# Altium schematic sheet 2_Smoke_detector.SchDoc (part 4 of 6)
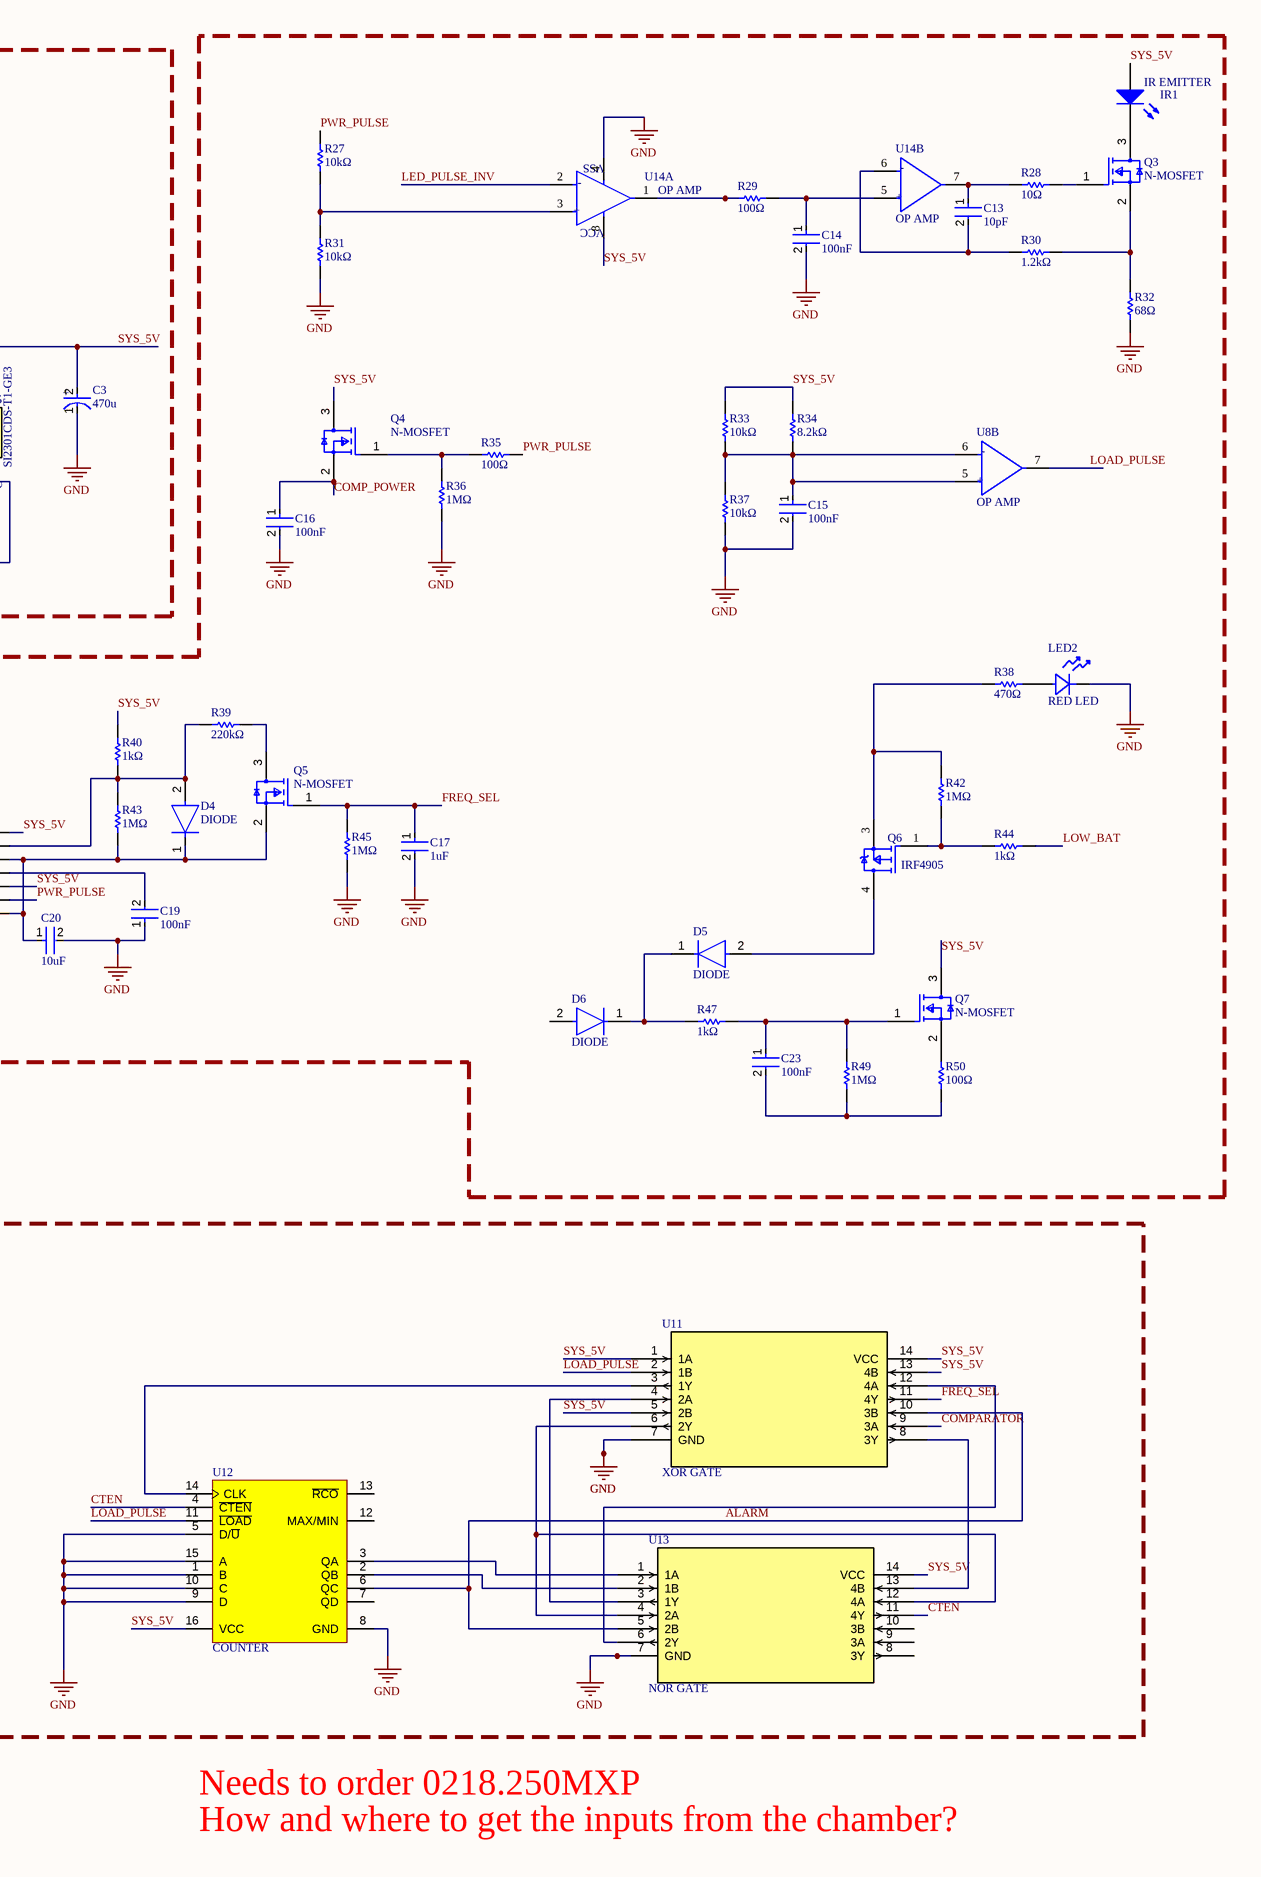
[diagram p4: 2_Smoke_detector.SchDoc, right]

## Library data of the parts (continued)
Q6 = IRF4905STRLPBF: MOSFET P-CH 55V 42A D2PAK; Manufacturer: Infineon; Drain to Source Breakdown Voltage: -55V; Drain to Source Resistance: 20mΩ; Element Configuration: Single; Fall Time: 64ns; Gate to Source Voltage (Vgs): 20V; Input Capacitance: 3.5nF; Max Junction Temperature (Tj): 150°C; Max Power Dissipation: 170W; Nominal Vgs: 4V; Number of Channels: 1; Power Dissipation: 150W; Value: 20mΩ; Rise Time: 99ns; Turn-Off Delay Time: 51ns; Turn-On Delay Time: 20ns; Supplier: Future Electronics; Supplier Part Number: IRF4905STRLPBF; Manufacturer Part Number: IRF4905STRLPBF; RoHS: Compliant; Category: MOSFETs; Stock: 20800; Pricing: 800=2.4 (USD); Case/Package: D2PAK; China RoHS: Non-Compliant; Continuous Drain Current (ID): 42A; Country of Origin: Mainland China; Drain to Source Voltage (Vdss): -55V; Dual Supply Voltage: 55V; Export Control Classification Number (ECCN) Code: EAR99; Height: 5.084mm; Harmonized Tariff Schedule (HTS) Code: 8541.29.00.95; Introduction Date: 1996-07-26; Lead Free: Lead Free; Length: 10.67mm; Lifecycle Status: Production; Max Operating Temperature: 150°C; Min Breakdown Voltage: 55V; Min Operating Temperature: -55°C; Mounting Technology: Surface Mount; Number of Elements: 1; Pins: 3; Number of Terminals: 2; On-State Resistance: 20mΩ; Package Quantity: 800; Packaging: Cut Tape; Radiation Hardening: No; Rds On Max: 20mΩ; REACH SVHC: Affected; Schedule B: 8541290080, 8541290080|8541290080|8541290080|8541290080|8541290080|8541290080|8541290080|8541290080|8541290080|8541290080|8541290080|8541290080|8541290080|8541290080|8541290080|8541290080|8541290080|8541290080|8541290080|8541290080|8541290080|8541290080|8541290080|85; Termination: SMD/SMT; Threshold Voltage: 4V; Width: 9.65mm; ComponentLink1URL: https://datasheet.octopart.com:443/IRF4905STRLPBF-Infineon-datasheet-7823242.pdf?src-supplier=element14+APAC; ComponentLink1Description: https://datasheet.octopart.com:443/IRF4905STRLPBF-Infineon-datasheet-7823242.pdf?src-supplier=element14+APAC; ComponentLink2URL: https://datasheet.octopart.com:443/IRF4905STRLPBF-Infineon-datasheet-6397759.pdf?src-supplier=element14+APAC; ComponentLink2Description: https://datasheet.octopart.com:443/IRF4905STRLPBF-Infineon-datasheet-6397759.pdf?src-supplier=element14+APAC; ComponentLink3URL: https://datasheet.octopart.com:443/IRF4905STRLPBF-Infineon-datasheet-180067141.pdf?src-supplier=IHS; ComponentLink3Description: https://datasheet.octopart.com:443/IRF4905STRLPBF-Infineon-datasheet-180067141.pdf?src-supplier=IHS; ComponentLink4URL: https://datasheet.octopart.com:443/IRF4905STRLPBF-Infineon-datasheet-9781395.pdf?src-supplier=RS+(Formerly+Allied+Electronics); ComponentLink4Description: https://datasheet.octopart.com:443/IRF4905STRLPBF-Infineon-datasheet-9781395.pdf?src-supplier=RS+(Formerly+Allied+Electronics); ComponentLink5URL: https://datasheet.octopart.com:443/IRF4905STRLPBF-International-Rectifier-datasheet-8761984.pdf?src-supplier=Jameco+(USA); ComponentLink5Description: https://datasheet.octopart.com:443/IRF4905STRLPBF-International-Rectifier-datasheet-8761984.pdf?src-supplier=Jameco+(USA); ComponentLink6URL: https://datasheet.octopart.com:443/IRF4905STRLPBF-International-Rectifier-datasheet-14060552.pdf?src-supplier=iiiC; ComponentLink6Description: https://datasheet.octopart.com:443/IRF4905STRLPBF-International-Rectifier-datasheet-14060552.pdf?src-supplier=iiiC; ComponentLink7URL: http://sigma.octopart.com:80/conflict_mineral_statement/Infineon-company-51.pdf?src-supplier=Compliance+Statements; ComponentLink7Description: http://sigma.octopart.com:80/conflict_mineral_statement/Infineon-company-51.pdf?src-supplier=Compliance+Statements; ComponentLink8URL: http://sigma.octopart.com:80/reach_statement/International-Rectifier-company-55.pdf?src-supplier=Compliance+Statements; ComponentLink8Description: http://sigma.octopart.com:80/reach_statement/International-Rectifier-company-55.pdf?src-supplier=Compliance+Statements; ComponentLink9URL: http://sigma.octopart.com:80/rohs_statement/International-Rectifier-company-54.pdf?src-supplier=Compliance+Statements; ComponentLink9Description: http://sigma.octopart.com:80/rohs_statement/International-Rectifier-company-54.pdf?src-supplier=Compliance+Statements; LCSC Part Number: C2620
R1 = RT0805BRD0728K7L: RES 28.7kΩ 0.1% 1/8W 0805; Manufacturer: Yageo Group; Manufacturer Package Identifier: 0805 (2012 metric); Max Power Dissipation: 125mW; Temperature Coefficient: 25ppm/°C; Voltage Rating: 150V; Supplier: Avnet; Supplier Part Number: RT0805BRD0728K7L; Manufacturer Part Number: RT0805BRD0728K7L; RoHS: Compliant; Category: Chip SMD Resistors; Pricing: 5000=0.0408, 10000=0.0406, 20000=0.04039, 40000=0.04019, 80000=0.03998 (USD); Case/Package: 0805; Case Code (Imperial): 0805; China RoHS: Non-Compliant; Composition: Thin Film; Country of Origin: Mainland China, Taiwan; Depth: 1.25mm; Export Control Classification Number (ECCN) Code: EAR99; Height: 500µm; Harmonized Tariff Schedule (HTS) Code: 8533.21.00.30; Introduction Date: 2008-06-09; Lead Free: Lead Free; Length: 2mm; Lifecycle Status: Production; Max Operating Temperature: 155°C; Military Standard: Not; Min Operating Temperature: -55°C; Mounting Technology: Surface Mount; Number of Terminals: 2; Number of Terminations: 2; Power Rating: 125mW; REACH SVHC: Unaffected; Value: 28.7kΩ; Termination: SMD/SMT; Tolerance: 0.1%; Voltage Rating (DC): 150V; Weight: 5.499807mg; Width: 1.25mm; Working Voltage: 150V; ComponentLink1URL: https://datasheet.octopart.com:443/RT0805BRD0728K7L-Yageo-datasheet-176402239.pdf?src-supplier=IHS; ComponentLink1Description: https://datasheet.octopart.com:443/RT0805BRD0728K7L-Yageo-datasheet-176402239.pdf?src-supplier=IHS; ComponentLink2URL: https://datasheet.octopart.com:443/RT0805BRD0728K7L-Yageo-datasheet-96443642.pdf?src-supplier=Upverter; ComponentLink2Description: https://datasheet.octopart.com:443/RT0805BRD0728K7L-Yageo-datasheet-96443642.pdf?src-supplier=Upverter; ComponentLink3URL: https://datasheet.octopart.com:443/RT0805BRD0728K7L-Yageo-Group-datasheet-141265893.pdf?src-supplier=ODG+(Origin+Data+Global); ComponentLink3Description: https://datasheet.octopart.com:443/RT0805BRD0728K7L-Yageo-Group-datasheet-141265893.pdf?src-supplier=ODG+(Origin+Data+Global); ComponentLink4URL: https://datasheet.octopart.com/RT0805BRD0728K7L-Yageo-datasheet-86813807.pdf; ComponentLink4Description: https://datasheet.octopart.com/RT0805BRD0728K7L-Yageo-datasheet-86813807.pdf; ComponentLink5URL: http://sigma.octopart.com:80/conflict_mineral_statement/Yageo-company-3.pdf?src-supplier=Compliance+Statements; ComponentLink5Description: http://sigma.octopart.com:80/conflict_mineral_statement/Yageo-company-3.pdf?src-supplier=Compliance+Statements; ComponentLink6URL: http://sigma.octopart.com:80/rohs_statement/Yageo-company-2.pdf?src-supplier=Compliance+Statements; ComponentLink6Description: http://sigma.octopart.com:80/rohs_statement/Yageo-company-2.pdf?src-supplier=Compliance+Statements; LCSC Part Number: C865355
R2 R11 R16 R20 R22 R24 R25 R27 R31 R33 R37 = CRCW080510K0FKEA: RES 10kΩ 1% 1/8W 0805; Manufacturer: Vishay; Manufacturer Package Identifier: CRCW0805-e3; Power Rating: 125mW; Temperature Coefficient: 100ppm/°C; Voltage Rating: 150V; Supplier: Future Electronics; Supplier Part Number: CRCW080510K0FKEA; Manufacturer Part Number: CRCW080510K0FKEA; RoHS: Compliant; Category: Chip SMD Resistors; Stock: 5460000; Pricing: 10000=0.0023, 50000=0.0022, 125000=0.0022, 375000=0.0021, 750000=0.002 (USD); Case/Package: 0805; Case Code (Imperial): 0805; China RoHS: Non-Compliant; Composition: Thick Film; Contact Plating: Tin; Country of Origin: Israel; Depth: 1.25mm; Export Control Classification Number (ECCN) Code: EAR99; Height: 450µm; Harmonized Tariff Schedule (HTS) Code: 8533.21.00.30; Introduction Date: 2005-02-16; Lead Free: Lead Free; Length: 2mm; Lifecycle Status: Production; Max Operating Temperature: 155°C; Military Standard: Not; Min Operating Temperature: -55°C; Mounting Technology: Surface Mount; Pins: 2; Number of Terminals: 2; Packaging: Cut Tape; Radiation Hardening: No; Ratings: AEC-Q200; REACH SVHC: Unaffected; Value: 10kΩ; Schedule B: 8533210045, 8533210045|8533210045|8533210045|8533210045|8533210045|8533210045|8533210045|8533210045|8533210045|8533210045|8533210045|8533210045|8533210045|8533210045|8533210045|8533210045|8533210045|8533210045|8533210045|8533210045|8533210045|8533210045|8533210045|85; Termination: SMD/SMT; Tolerance: 1%; Voltage Rating (DC): 150V; Weight: 5.499807mg; Width: 1.25mm; Working Voltage: 150V; ComponentLink1URL: https://datasheet.octopart.com:443/CRCW080510K0FKEA-Vishay-datasheet-175423584.pdf?src-supplier=IHS; ComponentLink1Description: https://datasheet.octopart.com:443/CRCW080510K0FKEA-Vishay-datasheet-175423584.pdf?src-supplier=IHS; ComponentLink2URL: https://datasheet.octopart.com:443/CRCW080510K0FKEA-Vishay-datasheet-5300368.pdf?src-supplier=Future+Electronics; ComponentLink2Description: https://datasheet.octopart.com:443/CRCW080510K0FKEA-Vishay-datasheet-5300368.pdf?src-supplier=Future+Electronics; ComponentLink3URL: https://datasheet.octopart.com:443/CRCW080510K0FKEA-Vishay-datasheet-62316122.pdf?src-supplier=Future+Electronics; ComponentLink3Description: https://datasheet.octopart.com:443/CRCW080510K0FKEA-Vishay-datasheet-62316122.pdf?src-supplier=Future+Electronics; ComponentLink4URL: https://datasheet.octopart.com:443/CRCW080510K0FKEA-Vishay-datasheet-83961561.pdf?src-supplier=Newark; ComponentLink4Description: https://datasheet.octopart.com:443/CRCW080510K0FKEA-Vishay-datasheet-83961561.pdf?src-supplier=Newark; ComponentLink5URL: https://datasheet.octopart.com:443/CRCW080510K0FKEA-Vishay-datasheet-14722531.pdf?src-supplier=Newark; ComponentLink5Description: https://datasheet.octopart.com:443/CRCW080510K0FKEA-Vishay-datasheet-14722531.pdf?src-supplier=Newark; ComponentLink6URL: https://datasheet.octopart.com:443/CRCW080510K0FKEA-Vishay-datasheet-62317937.pdf?src-supplier=Newark; ComponentLink6Description: https://datasheet.octopart.com:443/CRCW080510K0FKEA-Vishay-datasheet-62317937.pdf?src-supplier=Newark; ComponentLink7URL: https://datasheet.octopart.com:443/CRCW080510K0FKEA-Vishay-datasheet-11516975.pdf?src-supplier=Newark; ComponentLink7Description: https://datasheet.octopart.com:443/CRCW080510K0FKEA-Vishay-datasheet-11516975.pdf?src-supplier=Newark; ComponentLink8URL: https://datasheet.octopart.com:443/CRCW080510K0FKEA-Vishay-datasheet-183883877.pdf?src-supplier=Newark; ComponentLink8Description: https://datasheet.octopart.com:443/CRCW080510K0FKEA-Vishay-datasheet-183883877.pdf?src-supplier=Newark; ComponentLink9URL: https://datasheet.octopart.com:443/CRCW080510K0FKEA-Vishay-datasheet-41302739.pdf?src-supplier=Newark; ComponentLink9Description: https://datasheet.octopart.com:443/CRCW080510K0FKEA-Vishay-datasheet-41302739.pdf?src-supplier=Newark; ComponentLink10URL: https://datasheet.octopart.com:443/CRCW080510K0FKEA-Vishay-datasheet-27121962.pdf?src-supplier=Newark; ComponentLink10Description: https://datasheet.octopart.com:443/CRCW080510K0FKEA-Vishay-datasheet-27121962.pdf?src-supplier=Newark; ComponentLink11URL: https://datasheet.octopart.com:443/CRCW080510K0FKEA-Vishay-datasheet-16179825.pdf?src-supplier=element14+APAC; ComponentLink11Description: https://datasheet.octopart.com:443/CRCW080510K0FKEA-Vishay-datasheet-16179825.pdf?src-supplier=element14+APAC; ComponentLink12URL: https://datasheet.octopart.com:443/CRCW080510K0FKEA-Vishay-datasheet-66077789.pdf?src-supplier=element14+APAC; ComponentLink12Description: https://datasheet.octopart.com:443/CRCW080510K0FKEA-Vishay-datasheet-66077789.pdf?src-supplier=element14+APAC; ComponentLink13URL: https://datasheet.octopart.com:443/CRCW080510K0FKEA-Vishay-datasheet-5306405.pdf?src-supplier=RS+(Formerly+Allied+Electronics); ComponentLink13Description: https://datasheet.octopart.com:443/CRCW080510K0FKEA-Vishay-datasheet-5306405.pdf?src-supplier=RS+(Formerly+Allied+Electronics); ComponentLink14URL: https://datasheet.octopart.com:443/CRCW080510K0FKEA-Vishay-Dale-datasheet-47688880.pdf?src-supplier=RS+(Formerly+Allied+Electronics); ComponentLink14Description: https://datasheet.octopart.com:443/CRCW080510K0FKEA-Vishay-Dale-datasheet-47688880.pdf?src-supplier=RS+(Formerly+Allied+Electronics); ComponentLink15URL: https://datasheet.octopart.com:443/CRCW080510K0FKEA-Vishay-datasheet-12001583.pdf?src-supplier=RS+(Formerly+Allied+Electronics); ComponentLink15Description: https://datasheet.octopart.com:443/CRCW080510K0FKEA-Vishay-datasheet-12001583.pdf?src-supplier=RS+(Formerly+Allied+Electronics); ComponentLink16URL: https://datasheet.octopart.com:443/CRCW080510K0FKEA-Vishay-datasheet-17834126.pdf?src-supplier=TME; ComponentLink16Description: https://datasheet.octopart.com:443/CRCW080510K0FKEA-Vishay-datasheet-17834126.pdf?src-supplier=TME; ComponentLink17URL: https://datasheet.octopart.com/D-CRCW-e3-Standard-Thick-Film-Chip-Resistors-Vishay-datasheet-family-64.pdf; ComponentLink17Description: https://datasheet.octopart.com/D-CRCW-e3-Standard-Thick-Film-Chip-Resistors-Vishay-datasheet-family-64.pdf; ComponentLink18URL: https://datasheet.octopart.com:443/CRCW080510K0FKEA-Vishay-datasheet-13242068.pdf?src-supplier=Farnell; ComponentLink18Description: https://datasheet.octopart.com:443/CRCW080510K0FKEA-Vishay-datasheet-13242068.pdf?src-supplier=Farnell; ComponentLink19URL: https://datasheet.octopart.com:443/CRCW080510K0FKEA-Vishay-datasheet-13195083.pdf?src-supplier=Farnell; ComponentLink19Description: https://datasheet.octopart.com:443/CRCW080510K0FKEA-Vishay-datasheet-13195083.pdf?src-supplier=Farnell; ComponentLink20URL: https://datasheet.octopart.com:443/CRCW080510K0FKEA-Vishay-datasheet-13034211.pdf?src-supplier=Farnell; ComponentLink20Description: https://datasheet.octopart.com:443/CRCW080510K0FKEA-Vishay-datasheet-13034211.pdf?src-supplier=Farnell; ComponentLink21URL: https://datasheet.octopart.com:443/CRCW080510K0FKEA-Vishay-datasheet-12600034.pdf?src-supplier=Farnell; ComponentLink21Description: https://datasheet.octopart.com:443/CRCW080510K0FKEA-Vishay-datasheet-12600034.pdf?src-supplier=Farnell; ComponentLink22URL: https://datasheet.octopart.com:443/CRCW080510K0FKEA-Vishay-datasheet-12532161.pdf?src-supplier=Farnell; ComponentLink22Description: https://datasheet.octopart.com:443/CRCW080510K0FKEA-Vishay-datasheet-12532161.pdf?src-supplier=Farnell; ComponentLink23URL: https://datasheet.octopart.com:443/CRCW080510K0FKEA-Vishay-datasheet-12517896.pdf?src-supplier=Farnell; ComponentLink23Description: https://datasheet.octopart.com:443/CRCW080510K0FKEA-Vishay-datasheet-12517896.pdf?src-supplier=Farnell; ComponentLink24URL: https://datasheet.octopart.com:443/CRCW080510K0FKEA-Vishay-datasheet-12509762.pdf?src-supplier=Farnell; ComponentLink24Description: https://datasheet.octopart.com:443/CRCW080510K0FKEA-Vishay-datasheet-12509762.pdf?src-supplier=Farnell; ComponentLink25URL: https://datasheet.octopart.com:443/CRCW080510K0FKEA-Vishay-datasheet-10322335.pdf?src-supplier=Farnell; ComponentLink25Description: https://datasheet.octopart.com:443/CRCW080510K0FKEA-Vishay-datasheet-10322335.pdf?src-supplier=Farnell; ComponentLink26URL: https://datasheet.octopart.com:443/CRCW080510K0FKEA-Vishay-datasheet-8788789.pdf?src-supplier=Farnell; ComponentLink26Description: https://datasheet.octopart.com:443/CRCW080510K0FKEA-Vishay-datasheet-8788789.pdf?src-supplier=Farnell; ComponentLink27URL: https://datasheet.octopart.com:443/CRCW080510K0FKEA-Vishay-datasheet-8361388.pdf?src-supplier=Farnell; ComponentLink27Description: https://datasheet.octopart.com:443/CRCW080510K0FKEA-Vishay-datasheet-8361388.pdf?src-supplier=Farnell; ComponentLink28URL: https://datasheet.octopart.com:443/CRCW080510K0FKEA-Vishay-datasheet-546287.pdf?src-supplier=Farnell; ComponentLink28Description: https://datasheet.octopart.com:443/CRCW080510K0FKEA-Vishay-datasheet-546287.pdf?src-supplier=Farnell; ComponentLink29URL: https://datasheet.octopart.com:443/CRCW080510K0FKEA-Vishay-datasheet-11540273.pdf?src-supplier=Arrow+Electronics; ComponentLink29Description: https://datasheet.octopart.com:443/CRCW080510K0FKEA-Vishay-datasheet-11540273.pdf?src-supplier=Arrow+Electronics; ComponentLink30URL: https://datasheet.octopart.com:443/CRCW080510K0FKEA-Vishay-datasheet-8445837.pdf?src-supplier=element14; ComponentLink30Description: https://datasheet.octopart.com:443/CRCW080510K0FKEA-Vishay-datasheet-8445837.pdf?src-supplier=element14; ComponentLink31URL: https://datasheet.octopart.com:443/CRCW080510K0FKEA-Vishay-datasheet-5377306.pdf?src-supplier=Garrett; ComponentLink31Description: https://datasheet.octopart.com:443/CRCW080510K0FKEA-Vishay-datasheet-5377306.pdf?src-supplier=Garrett; ComponentLink32URL: https://datasheet.octopart.com:443/CRCW080510K0FKEA-Vishay-datasheet-148188.pdf?src-supplier=Garrett; ComponentLink32Description: https://datasheet.octopart.com:443/CRCW080510K0FKEA-Vishay-datasheet-148188.pdf?src-supplier=Garrett; ComponentLink33URL: https://datasheet.octopart.com:443/CRCW080510K0FKEA-Vishay-datasheet-34203.pdf?src-supplier=Garrett; ComponentLink33Description: https://datasheet.octopart.com:443/CRCW080510K0FKEA-Vishay-datasheet-34203.pdf?src-supplier=Garrett; ComponentLink34URL: http://sigma.octopart.com:80/rohs_certificate/D-CRCW-e3-Standard-Thick-Film-Chip-Resistors-Vishay-family-102.pdf?src-supplier=Compliance+Statements; ComponentLink34Description: http://sigma.octopart.com:80/rohs_certificate/D-CRCW-e3-Standard-Thick-Film-Chip-Resistors-Vishay-family-102.pdf?src-supplier=Compliance+Statements; LCSC Part Number: C844937
R3-R5 R7 R10 R14 = CRCW0805100KFKEA: RES 100kΩ 1% 1/8W 0805; Resistance: 100kR; Power Rating: 125mW; Voltage Rating: 150V; Temperature Coefficient: 100ppm/°C; Case/Package: 0805; Max Operating Temperature: 155°C; Case Code (Imperial): 0805; Lead Free: Lead Free; Weight: 0.000194oz; Number of Pins: 2; Package Quantity: 5000; Height: 0.45mm; Composition: Thick Film; Military Standard: Not; Tolerance: 1%; Case Code (Metric): 2012; Termination: SMD/SMT; Mount: Surface Mount; Radiation Hardening: No; Width: 1.25mm; Length: 2mm; Depth: 1.25mm; Packaging: Tape and Reel; Min Operating Temperature: -55°C; Contact Plating: Tin; Voltage Rating (DC): 150V; LCSC Part Number: C844935
R6 = RC0805FR-07330KL: RES 330kΩ 1% 1/8W 0805; Manufacturer: Yageo Group; Max Power Dissipation: 125mW; Temperature Coefficient: 100ppm/°C; Voltage Rating: 150V; Supplier: Future Electronics; Supplier Part Number: RC0805FR-07330KL; Manufacturer Part Number: RC0805FR-07330KL; RoHS: Compliant; Category: Chip SMD Resistors; Stock: 330000; Pricing: 5000=0.0068, 20000=0.0065, 75000=0.0063, 150000=0.0062, 375000=0.006 (USD); Case/Package: 0805; Case Code (Imperial): 0805; China RoHS: Non-Compliant; Composition: Thick Film; Contact Plating: Tin; Country of Origin: Mainland China, Taiwan; Depth: 1.25mm; Export Control Classification Number (ECCN) Code: EAR99; Features: Moisture Resistant; Height: 500µm; Harmonized Tariff Schedule (HTS) Code: 8533.21.00.30; Introduction Date: 2004-09-22; Lead Free: Lead Free; Length: 2mm; Lifecycle Status: Production; Max Operating Temperature: 155°C; Military Standard: Not; Min Operating Temperature: -55°C; Mounting Technology: Surface Mount; Pins: 2; Number of Terminals: 2; Number of Terminations: 2; Packaging: Tape & Reel; Power Rating: 125mW; Radiation Hardening: No; REACH SVHC: Unaffected; Value: 330kΩ; Schedule B: 8533210045, 8533210045|8533210045|8533210045|8533210045|8533210045; Termination: SMD/SMT; Tolerance: 1%; Voltage Rating (AC): 150V; Voltage Rating (DC): 150V; Width: 1.25mm; Working Voltage: 150V; ComponentLink1URL: https://datasheet.octopart.com:443/RC0805FR-07330KL-Yageo-datasheet-175887523.pdf?src-supplier=IHS; ComponentLink1Description: https://datasheet.octopart.com:443/RC0805FR-07330KL-Yageo-datasheet-175887523.pdf?src-supplier=IHS; ComponentLink2URL: https://datasheet.octopart.com:443/RC0805FR-07330KL-Yageo-datasheet-103092701.pdf?src-supplier=Upverter; ComponentLink2Description: https://datasheet.octopart.com:443/RC0805FR-07330KL-Yageo-datasheet-103092701.pdf?src-supplier=Upverter; ComponentLink3URL: https://datasheet.octopart.com:443/RC0805FR-07330KL-Yageo-datasheet-8330313.pdf?src-supplier=element14+APAC; ComponentLink3Description: https://datasheet.octopart.com:443/RC0805FR-07330KL-Yageo-datasheet-8330313.pdf?src-supplier=element14+APAC; ComponentLink4URL: https://datasheet.octopart.com:443/RC0805FR-07330KL-Yageo-Group-datasheet-190305687.pdf?src-supplier=Future+Electronics; ComponentLink4Description: https://datasheet.octopart.com:443/RC0805FR-07330KL-Yageo-Group-datasheet-190305687.pdf?src-supplier=Future+Electronics; ComponentLink5URL: https://datasheet.octopart.com:443/RC0805FR-07330KL-Yageo-datasheet-164759695.pdf?src-supplier=Future+Electronics; ComponentLink5Description: https://datasheet.octopart.com:443/RC0805FR-07330KL-Yageo-datasheet-164759695.pdf?src-supplier=Future+Electronics; ComponentLink6URL: https://datasheet.octopart.com:443/RC0805FR-07330KL-Yageo-datasheet-127823281.pdf?src-supplier=Future+Electronics; ComponentLink6Description: https://datasheet.octopart.com:443/RC0805FR-07330KL-Yageo-datasheet-127823281.pdf?src-supplier=Future+Electronics; ComponentLink7URL: https://datasheet.octopart.com:443/RC0805FR-07330KL-Yageo-datasheet-137700087.pdf?src-supplier=Future+Electronics; ComponentLink7Description: https://datasheet.octopart.com:443/RC0805FR-07330KL-Yageo-datasheet-137700087.pdf?src-supplier=Future+Electronics; ComponentLink8URL: https://datasheet.octopart.com:443/RC0805FR-07330KL-Yageo-datasheet-12592811.pdf?src-supplier=Future+Electronics; ComponentLink8Description: https://datasheet.octopart.com:443/RC0805FR-07330KL-Yageo-datasheet-12592811.pdf?src-supplier=Future+Electronics; ComponentLink9URL: https://datasheet.octopart.com:443/RC0805FR-07330KL-Yageo-datasheet-8324252.pdf?src-supplier=Future+Electronics; ComponentLink9Description: https://datasheet.octopart.com:443/RC0805FR-07330KL-Yageo-datasheet-8324252.pdf?src-supplier=Future+Electronics; ComponentLink10URL: https://datasheet.octopart.com:443/RC0805FR-07330KL-Yageo-datasheet-62067350.pdf?src-supplier=Farnell; ComponentLink10Description: https://datasheet.octopart.com:443/RC0805FR-07330KL-Yageo-datasheet-62067350.pdf?src-supplier=Farnell; ComponentLink11URL: https://datasheet.octopart.com:443/RC0805FR-07330KL-Yageo-datasheet-13691069.pdf?src-supplier=Farnell; ComponentLink11Description: https://datasheet.octopart.com:443/RC0805FR-07330KL-Yageo-datasheet-13691069.pdf?src-supplier=Farnell; ComponentLink12URL: https://datasheet.octopart.com:443/RC0805FR-07330KL-Yageo-Group-datasheet-189192902.pdf?src-supplier=LCSC; ComponentLink12Description: https://datasheet.octopart.com:443/RC0805FR-07330KL-Yageo-Group-datasheet-189192902.pdf?src-supplier=LCSC; ComponentLink13URL: https://datasheet.octopart.com/RC0805FR-07330KL-Yageo-datasheet-73766026.pdf; ComponentLink13Description: https://datasheet.octopart.com/RC0805FR-07330KL-Yageo-datasheet-73766026.pdf; ComponentLink14URL: https://datasheet.octopart.com:443/RC0805FR-07330KL-Yageo-datasheet-118657.pdf?src-supplier=DigiKey; ComponentLink14Description: https://datasheet.octopart.com:443/RC0805FR-07330KL-Yageo-datasheet-118657.pdf?src-supplier=DigiKey; ComponentLink15URL: http://sigma.octopart.com:80/conflict_mineral_statement/Yageo-company-3.pdf?src-supplier=Compliance+Statements; ComponentLink15Description: http://sigma.octopart.com:80/conflict_mineral_statement/Yageo-company-3.pdf?src-supplier=Compliance+Statements; ComponentLink16URL: http://sigma.octopart.com:80/rohs_statement/Yageo-company-2.pdf?src-supplier=Compliance+Statements; ComponentLink16Description: http://sigma.octopart.com:80/rohs_statement/Yageo-company-2.pdf?src-supplier=Compliance+Statements; LCSC Part Number: C114528
R8 R9 R18 R40 R44 R46 R47 = CRCW08051K00FKEA: RES 1kΩ 1% 1/8W 0805; Manufacturer: Vishay Dale; Part Number: CRCW08051K00FKEA; LCSC Part Number: C844939
R12 = CRCW080510M0FKEA: RES 10MΩ 1% 1/8W 0805; Manufacturer: Vishay; Manufacturer Package Identifier: CRCW0805-e3; Max Power Dissipation: 125mW; Temperature Coefficient: 100ppm/°C; Voltage Rating: 150V; Supplier: Future Electronics; Supplier Part Number: CRCW080510M0FKEA; Manufacturer Part Number: CRCW080510M0FKEA; RoHS: Compliant; Category: Chip SMD Resistors; Stock: 85000; Pricing: 5000=0.0094, 20000=0.0091, 50000=0.0089, 125000=0.0087, 200000=0.0084 (USD); Case/Package: 0805; Case Code (Imperial): 0805; China RoHS: Non-Compliant; Composition: Thick Film; Contact Plating: Tin; Country of Origin: Israel; Depth: 1.25mm; Export Control Classification Number (ECCN) Code: EAR99; Features: Automotive AEC-Q200; Height: 450µm; Harmonized Tariff Schedule (HTS) Code: 8533.21.00.30; Introduction Date: 2005-02-16; Lead Free: Lead Free; Length: 2mm; Lifecycle Status: Production; Max Operating Temperature: 155°C; Military Standard: Not; Min Operating Temperature: -55°C; Mounting Technology: Surface Mount; Pins: 2; Number of Terminals: 2; Number of Terminations: 2; Packaging: Cut Tape; Power Rating: 125mW; Radiation Hardening: No; Ratings: AEC-Q200; REACH SVHC: Unaffected; Value: 10MΩ; Schedule B: 8533210045, 8533210045|8533210045|8533210045|8533210045|8533210045|8533210045|8533210045|8533210045|8533210045|8533210045|8533210045|8533210045|8533210045|8533210045|8533210045|8533210045|8533210045|8533210045|8533210045|8533210045|8533210045|8533210045|8533210045|85; Termination: SMD/SMT; Tolerance: 1%; Voltage Rating (DC): 150V; Weight: 5.499807mg; Width: 1.25mm; Working Voltage: 150V; ComponentLink1URL: https://datasheet.octopart.com:443/CRCW080510M0FKEA-Vishay-datasheet-175423584.pdf?src-supplier=IHS; ComponentLink1Description: https://datasheet.octopart.com:443/CRCW080510M0FKEA-Vishay-datasheet-175423584.pdf?src-supplier=IHS; ComponentLink2URL: https://datasheet.octopart.com:443/CRCW080510M0FKEA-Vishay-datasheet-83961561.pdf?src-supplier=element14+APAC; ComponentLink2Description: https://datasheet.octopart.com:443/CRCW080510M0FKEA-Vishay-datasheet-83961561.pdf?src-supplier=element14+APAC; ComponentLink3URL: https://datasheet.octopart.com:443/CRCW080510M0FKEA-Vishay-datasheet-66077789.pdf?src-supplier=element14+APAC; ComponentLink3Description: https://datasheet.octopart.com:443/CRCW080510M0FKEA-Vishay-datasheet-66077789.pdf?src-supplier=element14+APAC; ComponentLink4URL: https://datasheet.octopart.com:443/CRCW080510M0FKEA-Vishay-datasheet-62317939.pdf?src-supplier=element14+APAC; ComponentLink4Description: https://datasheet.octopart.com:443/CRCW080510M0FKEA-Vishay-datasheet-62317939.pdf?src-supplier=element14+APAC; ComponentLink5URL: https://datasheet.octopart.com:443/CRCW080510M0FKEA-Vishay-datasheet-14722531.pdf?src-supplier=element14+APAC; ComponentLink5Description: https://datasheet.octopart.com:443/CRCW080510M0FKEA-Vishay-datasheet-14722531.pdf?src-supplier=element14+APAC; ComponentLink6URL: https://datasheet.octopart.com:443/CRCW080510M0FKEA-Vishay-datasheet-16179825.pdf?src-supplier=element14+APAC; ComponentLink6Description: https://datasheet.octopart.com:443/CRCW080510M0FKEA-Vishay-datasheet-16179825.pdf?src-supplier=element14+APAC; ComponentLink7URL: https://datasheet.octopart.com:443/CRCW080510M0FKEA.-Vishay-datasheet-78776211.pdf?src-supplier=Newark; ComponentLink7Description: https://datasheet.octopart.com:443/CRCW080510M0FKEA.-Vishay-datasheet-78776211.pdf?src-supplier=Newark; ComponentLink8URL: https://datasheet.octopart.com:443/CRCW080510M0FKEA-Vishay-datasheet-11516975.pdf?src-supplier=Newark; ComponentLink8Description: https://datasheet.octopart.com:443/CRCW080510M0FKEA-Vishay-datasheet-11516975.pdf?src-supplier=Newark; ComponentLink9URL: https://datasheet.octopart.com:443/CRCW080510M0FKEA-Vishay-datasheet-41302739.pdf?src-supplier=Newark; ComponentLink9Description: https://datasheet.octopart.com:443/CRCW080510M0FKEA-Vishay-datasheet-41302739.pdf?src-supplier=Newark; ComponentLink10URL: https://datasheet.octopart.com:443/CRCW080510M0FKEA-Vishay-datasheet-8.pdf?src-supplier=Newark; ComponentLink10Description: https://datasheet.octopart.com:443/CRCW080510M0FKEA-Vishay-datasheet-8.pdf?src-supplier=Newark; ComponentLink11URL: https://datasheet.octopart.com:443/CRCW080510M0FKEA-Vishay-datasheet-8725101.pdf?src-supplier=element14; ComponentLink11Description: https://datasheet.octopart.com:443/CRCW080510M0FKEA-Vishay-datasheet-8725101.pdf?src-supplier=element14; ComponentLink12URL: https://datasheet.octopart.com:443/CRCW080510M0FKEA-Vishay-datasheet-5306405.pdf?src-supplier=Future+Electronics; ComponentLink12Description: https://datasheet.octopart.com:443/CRCW080510M0FKEA-Vishay-datasheet-5306405.pdf?src-supplier=Future+Electronics; ComponentLink13URL: https://datasheet.octopart.com:443/CRCW080510M0FKEA-Vishay-datasheet-62316122.pdf?src-supplier=Future+Electronics; ComponentLink13Description: https://datasheet.octopart.com:443/CRCW080510M0FKEA-Vishay-datasheet-62316122.pdf?src-supplier=Future+Electronics; ComponentLink14URL: https://datasheet.octopart.com:443/CRCW080510M0FKEA-Vishay-datasheet-13242068.pdf?src-supplier=Future+Electronics; ComponentLink14Description: https://datasheet.octopart.com:443/CRCW080510M0FKEA-Vishay-datasheet-13242068.pdf?src-supplier=Future+Electronics; ComponentLink15URL: https://datasheet.octopart.com:443/CRCW080510M0FKEA-Vishay-datasheet-13195083.pdf?src-supplier=Future+Electronics; ComponentLink15Description: https://datasheet.octopart.com:443/CRCW080510M0FKEA-Vishay-datasheet-13195083.pdf?src-supplier=Future+Electronics; ComponentLink16URL: https://datasheet.octopart.com:443/CRCW080510M0FKEA-Vishay-datasheet-13034211.pdf?src-supplier=Future+Electronics; ComponentLink16Description: https://datasheet.octopart.com:443/CRCW080510M0FKEA-Vishay-datasheet-13034211.pdf?src-supplier=Future+Electronics; ComponentLink17URL: https://datasheet.octopart.com:443/CRCW080510M0FKEA-Vishay-datasheet-12600034.pdf?src-supplier=Future+Electronics; ComponentLink17Description: https://datasheet.octopart.com:443/CRCW080510M0FKEA-Vishay-datasheet-12600034.pdf?src-supplier=Future+Electronics; ComponentLink18URL: https://datasheet.octopart.com:443/CRCW080510M0FKEA-Vishay-datasheet-12532161.pdf?src-supplier=Future+Electronics; ComponentLink18Description: https://datasheet.octopart.com:443/CRCW080510M0FKEA-Vishay-datasheet-12532161.pdf?src-supplier=Future+Electronics; ComponentLink19URL: https://datasheet.octopart.com:443/CRCW080510M0FKEA-Vishay-datasheet-12517896.pdf?src-supplier=Future+Electronics; ComponentLink19Description: https://datasheet.octopart.com:443/CRCW080510M0FKEA-Vishay-datasheet-12517896.pdf?src-supplier=Future+Electronics; ComponentLink20URL: https://datasheet.octopart.com:443/CRCW080510M0FKEA-Vishay-datasheet-12509762.pdf?src-supplier=Future+Electronics; ComponentLink20Description: https://datasheet.octopart.com:443/CRCW080510M0FKEA-Vishay-datasheet-12509762.pdf?src-supplier=Future+Electronics; ComponentLink21URL: https://datasheet.octopart.com:443/CRCW080510M0FKEA-Vishay-datasheet-10322335.pdf?src-supplier=Future+Electronics; ComponentLink21Description: https://datasheet.octopart.com:443/CRCW080510M0FKEA-Vishay-datasheet-10322335.pdf?src-supplier=Future+Electronics; ComponentLink22URL: https://datasheet.octopart.com:443/CRCW080510M0FKEA-Vishay-datasheet-8788789.pdf?src-supplier=Future+Electronics; ComponentLink22Description: https://datasheet.octopart.com:443/CRCW080510M0FKEA-Vishay-datasheet-8788789.pdf?src-supplier=Future+Electronics; ComponentLink23URL: https://datasheet.octopart.com:443/CRCW080510M0FKEA-Vishay-datasheet-8361388.pdf?src-supplier=Future+Electronics; ComponentLink23Description: https://datasheet.octopart.com:443/CRCW080510M0FKEA-Vishay-datasheet-8361388.pdf?src-supplier=Future+Electronics; ComponentLink24URL: https://datasheet.octopart.com:443/CRCW080510M0FKEA-Vishay-datasheet-546287.pdf?src-supplier=Future+Electronics; ComponentLink24Description: https://datasheet.octopart.com:443/CRCW080510M0FKEA-Vishay-datasheet-546287.pdf?src-supplier=Future+Electronics; ComponentLink25URL: https://datasheet.octopart.com:443/CRCW080510M0FKEA-Vishay-datasheet-137114595.pdf?src-supplier=X-ON; ComponentLink25Description: https://datasheet.octopart.com:443/CRCW080510M0FKEA-Vishay-datasheet-137114595.pdf?src-supplier=X-ON; ComponentLink26URL: https://datasheet.octopart.com:443/CRCW080510M0FKEA-Vishay-Dale-datasheet-47688880.pdf?src-supplier=RS+(Formerly+Allied+Electronics); ComponentLink26Description: https://datasheet.octopart.com:443/CRCW080510M0FKEA-Vishay-Dale-datasheet-47688880.pdf?src-supplier=RS+(Formerly+Allied+Electronics); ComponentLink27URL: https://datasheet.octopart.com:443/CRCW080510M0FKEA-Vishay-datasheet-12001583.pdf?src-supplier=RS+(Formerly+Allied+Electronics); ComponentLink27Description: https://datasheet.octopart.com:443/CRCW080510M0FKEA-Vishay-datasheet-12001583.pdf?src-supplier=RS+(Formerly+Allied+Electronics); ComponentLink28URL: https://datasheet.octopart.com/D-CRCW-e3-Standard-Thick-Film-Chip-Resistors-Vishay-datasheet-family-64.pdf; ComponentLink28Description: https://datasheet.octopart.com/D-CRCW-e3-Standard-Thick-Film-Chip-Resistors-Vishay-datasheet-family-64.pdf; ComponentLink29URL: https://datasheet.octopart.com:443/CRCW080510M0FKEA-Vishay-datasheet-5377306.pdf?src-supplier=Garrett; ComponentLink29Description: https://datasheet.octopart.com:443/CRCW080510M0FKEA-Vishay-datasheet-5377306.pdf?src-supplier=Garrett; ComponentLink30URL: http://sigma.octopart.com:80/rohs_certificate/D-CRCW-e3-Standard-Thick-Film-Chip-Resistors-Vishay-family-102.pdf?src-supplier=Compliance+Statements; ComponentLink30Description: http://sigma.octopart.com:80/rohs_certificate/D-CRCW-e3-Standard-Thick-Film-Chip-Resistors-Vishay-family-102.pdf?src-supplier=Compliance+Statements; LCSC Part Number: C844596
R13 = CRCW08052K70FKEA: RES 2.7kΩ 1% 1/8W 0805; Voltage Rating (DC): 150V; Power Rating: 125mW; Resistance: 2.7kR; Temperature Coefficient: 100ppm/°C; Composition: Thick Film; Mount: Surface Mount; Case Code (Imperial): 0805; Features: Automotive AEC-Q200; Depth: 1.25mm; Height: 0.45mm; Weight: 0.000194oz; Min Operating Temperature: -55°C; Case Code (Metric): 2012; Number of Pins: 2; Packaging: Tape and Reel; Width: 1.25mm; Military Standard: Not; Max Power Dissipation: 125mW; Tolerance: 1%; Case/Package: 0805; Lead Free: Lead Free; Max Operating Temperature: 155°C; Number of Terminations: 2; Voltage Rating: 150V; Contact Plating: Tin; Length: 2mm; Termination: SMD/SMT; Package Quantity: 10; Radiation Hardening: No; LCSC Part Number: C844836
R15 = CRCW080562K0FKEA: RES 62kΩ 1% 1/8W 0805; Manufacturer: Vishay; Manufacturer Package Identifier: CRCW0805-e3; Power Rating: 125mW; Temperature Coefficient: 100ppm/°C; Voltage Rating: 150V; Supplier: Arrow Electronics; Supplier Part Number: CRCW080562K0FKEA; Manufacturer Part Number: CRCW080562K0FKEA; RoHS: Compliant; Category: Chip SMD Resistors; Stock: 9790; Pricing: 1=0.0045 (USD); Case/Package: 0805; Case Code (Imperial): 0805; China RoHS: Non-Compliant; Composition: Thick Film; Contact Plating: Tin; Depth: 1.25mm; Height: 450µm; Lead Free: Lead Free; Length: 2mm; Lifecycle Status: Production; Max Operating Temperature: 155°C; Military Standard: Not; Min Operating Temperature: -55°C; Mounting Technology: Surface Mount; Pins: 2; Number of Terminals: 2; Packaging: Cut Tape; Radiation Hardening: No; Ratings: AEC-Q200; REACH SVHC: Unaffected; Value: 62kΩ; Schedule B: 8533210045, 8533210045|8533210045|8533210045|8533210045|8533210045|8533210045|8533210045|8533210045|8533210045|8533210045|8533210045|8533210045|8533210045|8533210045|8533210045|8533210045|8533210045|8533210045|8533210045|8533210045|8533210045|8533210045|8533210045|85; Termination: SMD/SMT; Tolerance: 1%; Voltage Rating (DC): 150V; Weight: 5.499807mg; Width: 1.25mm; Working Voltage: 150V; ComponentLink1URL: https://datasheet.octopart.com:443/CRCW080562K0FKEA-Vishay-datasheet-175423584.pdf?src-supplier=IHS; ComponentLink1Description: https://datasheet.octopart.com:443/CRCW080562K0FKEA-Vishay-datasheet-175423584.pdf?src-supplier=IHS; ComponentLink2URL: https://datasheet.octopart.com:443/CRCW080562K0FKEA-Vishay-datasheet-83961561.pdf?src-supplier=Newark; ComponentLink2Description: https://datasheet.octopart.com:443/CRCW080562K0FKEA-Vishay-datasheet-83961561.pdf?src-supplier=Newark; ComponentLink3URL: https://datasheet.octopart.com:443/CRCW080562K0FKEA-Vishay-datasheet-11761042.pdf?src-supplier=Newark; ComponentLink3Description: https://datasheet.octopart.com:443/CRCW080562K0FKEA-Vishay-datasheet-11761042.pdf?src-supplier=Newark; ComponentLink4URL: https://datasheet.octopart.com:443/CRCW080562K0FKEA-Vishay-datasheet-11516975.pdf?src-supplier=Newark; ComponentLink4Description: https://datasheet.octopart.com:443/CRCW080562K0FKEA-Vishay-datasheet-11516975.pdf?src-supplier=Newark; ComponentLink5URL: https://datasheet.octopart.com:443/CRCW080562K0FKEA-Vishay-datasheet-41302739.pdf?src-supplier=Newark; ComponentLink5Description: https://datasheet.octopart.com:443/CRCW080562K0FKEA-Vishay-datasheet-41302739.pdf?src-supplier=Newark; ComponentLink6URL: https://datasheet.octopart.com:443/CRCW080562K0FKEA-Vishay-datasheet-27121962.pdf?src-supplier=Newark; ComponentLink6Description: https://datasheet.octopart.com:443/CRCW080562K0FKEA-Vishay-datasheet-27121962.pdf?src-supplier=Newark; ComponentLink7URL: https://datasheet.octopart.com:443/CRCW080562K0FKEA-Vishay-datasheet-66077789.pdf?src-supplier=element14+APAC; ComponentLink7Description: https://datasheet.octopart.com:443/CRCW080562K0FKEA-Vishay-datasheet-66077789.pdf?src-supplier=element14+APAC; ComponentLink8URL: https://datasheet.octopart.com:443/CRCW080562K0FKEA-Vishay-datasheet-62317937.pdf?src-supplier=element14+APAC; ComponentLink8Description: https://datasheet.octopart.com:443/CRCW080562K0FKEA-Vishay-datasheet-62317937.pdf?src-supplier=element14+APAC; ComponentLink9URL: https://datasheet.octopart.com:443/CRCW080562K0FKEA.-Vishay-datasheet-78776209.pdf?src-supplier=element14+APAC; ComponentLink9Description: https://datasheet.octopart.com:443/CRCW080562K0FKEA.-Vishay-datasheet-78776209.pdf?src-supplier=element14+APAC; ComponentLink10URL: https://datasheet.octopart.com:443/CRCW080562K0FKEA-Vishay-datasheet-14722531.pdf?src-supplier=element14+APAC; ComponentLink10Description: https://datasheet.octopart.com:443/CRCW080562K0FKEA-Vishay-datasheet-14722531.pdf?src-supplier=element14+APAC; ComponentLink11URL: https://datasheet.octopart.com:443/CRCW080562K0FKEA-Vishay-datasheet-31669108.pdf?src-supplier=Farnell; ComponentLink11Description: https://datasheet.octopart.com:443/CRCW080562K0FKEA-Vishay-datasheet-31669108.pdf?src-supplier=Farnell; ComponentLink12URL: https://datasheet.octopart.com:443/CRCW080562K0FKEA-Vishay-datasheet-159614168.pdf?src-supplier=JRH+Electronics; ComponentLink12Description: https://datasheet.octopart.com:443/CRCW080562K0FKEA-Vishay-datasheet-159614168.pdf?src-supplier=JRH+Electronics; ComponentLink13URL: https://datasheet.octopart.com:443/CRCW080562K0FKEA-Vishay-datasheet-62316122.pdf?src-supplier=Future+Electronics; ComponentLink13Description: https://datasheet.octopart.com:443/CRCW080562K0FKEA-Vishay-datasheet-62316122.pdf?src-supplier=Future+Electronics; ComponentLink14URL: https://datasheet.octopart.com:443/CRCW080562K0FKEA-Vishay-datasheet-12543454.pdf?src-supplier=Future+Electronics; ComponentLink14Description: https://datasheet.octopart.com:443/CRCW080562K0FKEA-Vishay-datasheet-12543454.pdf?src-supplier=Future+Electronics; ComponentLink15URL: https://datasheet.octopart.com:443/CRCW080562K0FKEA-Vishay-Dale-datasheet-47688880.pdf?src-supplier=RS+(Formerly+Allied+Electronics); ComponentLink15Description: https://datasheet.octopart.com:443/CRCW080562K0FKEA-Vishay-Dale-datasheet-47688880.pdf?src-supplier=RS+(Formerly+Allied+Electronics); ComponentLink16URL: https://datasheet.octopart.com:443/CRCW080562K0FKEA-Vishay-datasheet-8445837.pdf?src-supplier=element14; ComponentLink16Description: https://datasheet.octopart.com:443/CRCW080562K0FKEA-Vishay-datasheet-8445837.pdf?src-supplier=element14; ComponentLink17URL: http://sigma.octopart.com:80/rohs_statement/Vishay-company-15.pdf?src-supplier=Compliance+Statements; ComponentLink17Description: http://sigma.octopart.com:80/rohs_statement/Vishay-company-15.pdf?src-supplier=Compliance+Statements; LCSC Part Number: C844009
R17 R23 R36 R42 R43 R45 R49 = RC0805FR-071ML: RES 1MΩ ±1% 125mW 0805; Manufacturer: Yageo Group; Temperature Coefficient: 100ppm/°C; Voltage Rating: 150V; Supplier: Future Electronics; Supplier Part Number: RC0805FR-071ML; Manufacturer Part Number: RC0805FR-071ML; RoHS: Compliant; Category: Chip SMD Resistors; Stock: 645000; Pricing: 5000=0.0068, 20000=0.0065, 75000=0.0063, 150000=0.0062, 375000=0.006 (USD); Case/Package: 0805; Case Code (Imperial): 0805; China RoHS: Non-Compliant; Composition: Thick Film; Contact Plating: Tin; Country of Origin: Mainland China, Taiwan; Depth: 1.25mm; Export Control Classification Number (ECCN) Code: EAR99; Features: Moisture Resistant; Height: 500µm; Harmonized Tariff Schedule (HTS) Code: 8533.21.00.30; Introduction Date: 2004-09-22; Lead Free: Lead Free; Length: 2mm; Lifecycle Status: Production; Max Operating Temperature: 155°C; Max Power Dissipation: 125mW; Military Standard: Not; Min Operating Temperature: -55°C; Mounting Technology: Surface Mount; Pins: 2; Number of Terminals: 2; Number of Terminations: 2; Packaging: Tape & Reel; Power Rating: 125mW; Radiation Hardening: No; REACH SVHC: Unaffected; Value: 1MΩ; Schedule B: 8533210045, 8533210045|8533210045, 8533210045|8533210045|8533210045, 8533210045|8533210045|8533210045|8533210045; Termination: SMD/SMT; Tolerance: 1%; Voltage Rating (AC): 150V; Voltage Rating (DC): 150V; Width: 1.25mm; Working Voltage: 150V; ComponentLink1URL: https://datasheet.octopart.com:443/RC0805FR-071ML-Yageo-datasheet-175887523.pdf?src-supplier=IHS; ComponentLink1Description: https://datasheet.octopart.com:443/RC0805FR-071ML-Yageo-datasheet-175887523.pdf?src-supplier=IHS; ComponentLink2URL: https://datasheet.octopart.com:443/RC0805FR-071ML-Yageo-datasheet-103092701.pdf?src-supplier=Upverter; ComponentLink2Description: https://datasheet.octopart.com:443/RC0805FR-071ML-Yageo-datasheet-103092701.pdf?src-supplier=Upverter; ComponentLink3URL: https://datasheet.octopart.com:443/RC0805FR-071ML-Yageo-datasheet-79472498.pdf?src-supplier=Upverter; ComponentLink3Description: https://datasheet.octopart.com:443/RC0805FR-071ML-Yageo-datasheet-79472498.pdf?src-supplier=Upverter; ComponentLink4URL: https://datasheet.octopart.com:443/RC0805FR-071ML-Yageo-datasheet-8330313.pdf?src-supplier=element14+APAC; ComponentLink4Description: https://datasheet.octopart.com:443/RC0805FR-071ML-Yageo-datasheet-8330313.pdf?src-supplier=element14+APAC; ComponentLink5URL: https://datasheet.octopart.com:443/RC0805FR-071ML-Yageo-Group-datasheet-190305687.pdf?src-supplier=Future+Electronics; ComponentLink5Description: https://datasheet.octopart.com:443/RC0805FR-071ML-Yageo-Group-datasheet-190305687.pdf?src-supplier=Future+Electronics; ComponentLink6URL: https://datasheet.octopart.com:443/RC0805FR-071ML-Yageo-datasheet-164759695.pdf?src-supplier=Future+Electronics; ComponentLink6Description: https://datasheet.octopart.com:443/RC0805FR-071ML-Yageo-datasheet-164759695.pdf?src-supplier=Future+Electronics; ComponentLink7URL: https://datasheet.octopart.com:443/RC0805FR-071ML-Yageo-datasheet-127823281.pdf?src-supplier=Future+Electronics; ComponentLink7Description: https://datasheet.octopart.com:443/RC0805FR-071ML-Yageo-datasheet-127823281.pdf?src-supplier=Future+Electronics; ComponentLink8URL: https://datasheet.octopart.com:443/RC0805FR-071ML-Yageo-datasheet-137700087.pdf?src-supplier=Future+Electronics; ComponentLink8Description: https://datasheet.octopart.com:443/RC0805FR-071ML-Yageo-datasheet-137700087.pdf?src-supplier=Future+Electronics; ComponentLink9URL: https://datasheet.octopart.com:443/RC0805FR-071ML-Yageo-datasheet-12592811.pdf?src-supplier=Future+Electronics; ComponentLink9Description: https://datasheet.octopart.com:443/RC0805FR-071ML-Yageo-datasheet-12592811.pdf?src-supplier=Future+Electronics; ComponentLink10URL: https://datasheet.octopart.com:443/RC0805FR-071ML-Yageo-datasheet-8324252.pdf?src-supplier=Future+Electronics; ComponentLink10Description: https://datasheet.octopart.com:443/RC0805FR-071ML-Yageo-datasheet-8324252.pdf?src-supplier=Future+Electronics; ComponentLink11URL: https://datasheet.octopart.com:443/RC0805FR-071ML-Yageo-datasheet-62067350.pdf?src-supplier=Farnell; ComponentLink11Description: https://datasheet.octopart.com:443/RC0805FR-071ML-Yageo-datasheet-62067350.pdf?src-supplier=Farnell; ComponentLink12URL: https://datasheet.octopart.com:443/RC0805FR-071ML-Yageo-datasheet-13691069.pdf?src-supplier=Farnell; ComponentLink12Description: https://datasheet.octopart.com:443/RC0805FR-071ML-Yageo-datasheet-13691069.pdf?src-supplier=Farnell; ComponentLink13URL: https://datasheet.octopart.com/RC0805FR-071ML-Yageo-datasheet-73766026.pdf; ComponentLink13Description: https://datasheet.octopart.com/RC0805FR-071ML-Yageo-datasheet-73766026.pdf; ComponentLink14URL: https://datasheet.octopart.com:443/RC0805FR-071ML-Yageo-datasheet-118657.pdf?src-supplier=DigiKey; ComponentLink14Description: https://datasheet.octopart.com:443/RC0805FR-071ML-Yageo-datasheet-118657.pdf?src-supplier=DigiKey; ComponentLink15URL: https://datasheet.octopart.com:443/RC0805FR-071ML-Yageo-datasheet-502840.pdf?src-supplier=element14; ComponentLink15Description: https://datasheet.octopart.com:443/RC0805FR-071ML-Yageo-datasheet-502840.pdf?src-supplier=element14; ComponentLink16URL: http://sigma.octopart.com:80/conflict_mineral_statement/Yageo-company-3.pdf?src-supplier=Compliance+Statements; ComponentLink16Description: http://sigma.octopart.com:80/conflict_mineral_statement/Yageo-company-3.pdf?src-supplier=Compliance+Statements; ComponentLink17URL: http://sigma.octopart.com:80/rohs_statement/Yageo-company-2.pdf?src-supplier=Compliance+Statements; ComponentLink17Description: http://sigma.octopart.com:80/rohs_statement/Yageo-company-2.pdf?src-supplier=Compliance+Statements; LCSC: C107700; LCSC Part Number: C107700